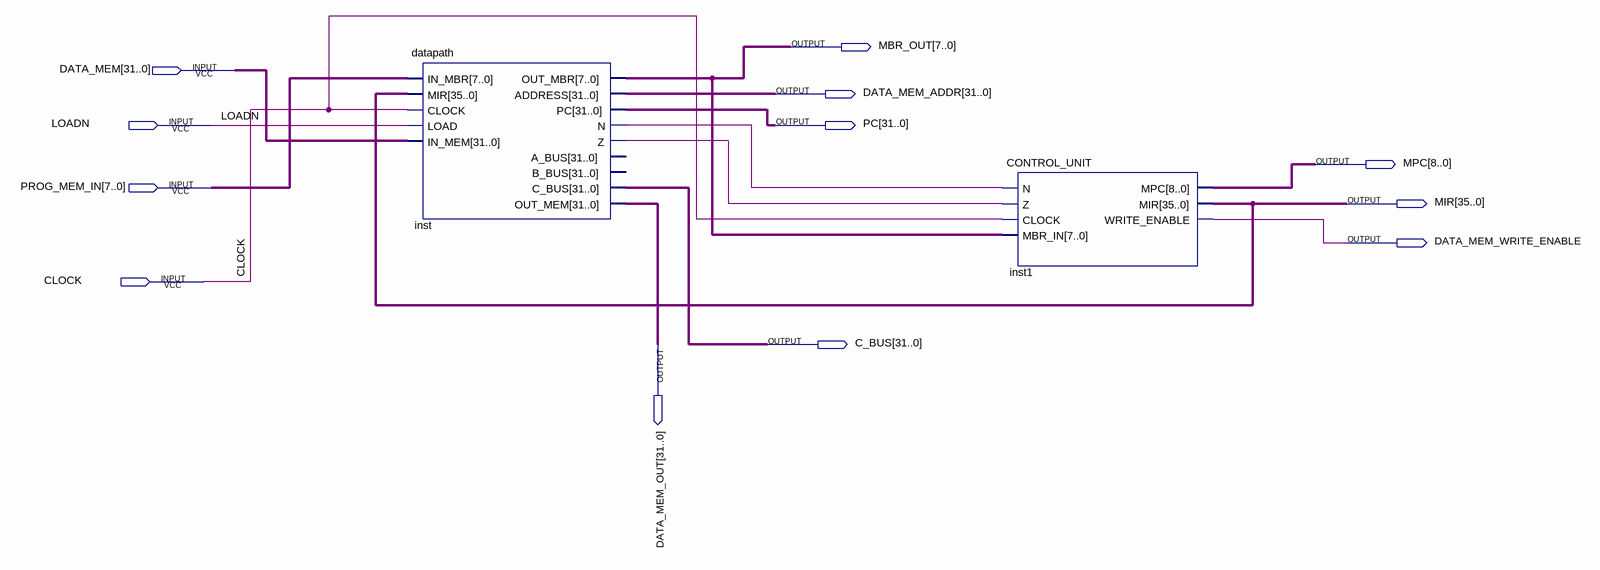
[diagram p0: schematic sheet]
// Quartus schematic CPU.bdf as structural Verilog: 2 symbols, 12 pins
module CPU (
  input  [31:0] DATA_MEM,
  input  LOADN,
  input  [7:0] PROG_MEM_IN,
  input  CLOCK,
  output [7:0] MBR_OUT,
  output [31:0] DATA_MEM_ADDR,
  output [31:0] PC,
  output [8:0] MPC,
  output [35:0] MIR,
  output DATA_MEM_WRITE_ENABLE,
  output [31:0] DATA_MEM_OUT,
  output [31:0] C_BUS
);

  wire inst_n, inst_z;

  datapath inst (
    .IN_MBR(PROG_MEM_IN), .MIR(MIR), .CLOCK(CLOCK), .LOAD(LOADN), .IN_MEM(DATA_MEM), .OUT_MBR(MBR_OUT),
    .ADDRESS(DATA_MEM_ADDR), .PC(PC), .N(inst_n), .Z(inst_z), .C_BUS(C_BUS), .OUT_MEM(DATA_MEM_OUT));  // open: A_BUS, B_BUS
  CONTROL_UNIT inst1 (
    .N(inst_n), .Z(inst_z), .CLOCK(CLOCK), .MBR_IN(MBR_OUT), .MPC(MPC), .MIR(MIR),
    .WRITE_ENABLE(DATA_MEM_WRITE_ENABLE));
endmodule
